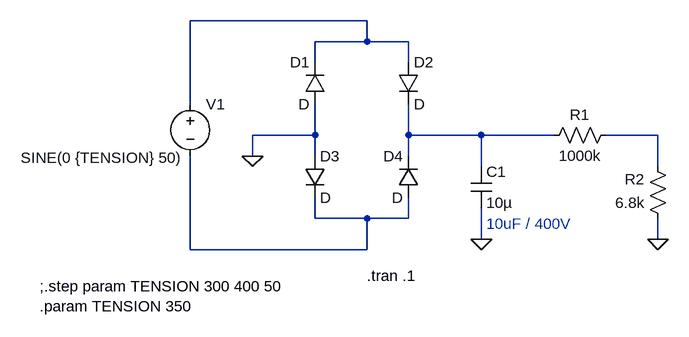
[diagram p0: schematic TensionSensor1.asc]
TensionSensor1.asc, the LTspice schematic file:
Version 4
SHEET 1 880 680
WIRE -272 48 -544 48
WIRE -272 80 -272 48
WIRE -272 80 -352 80
WIRE -208 80 -272 80
WIRE -352 112 -352 80
WIRE -208 112 -208 80
WIRE -544 176 -544 48
WIRE -352 224 -352 176
WIRE -352 224 -448 224
WIRE -208 224 -208 176
WIRE -96 224 -208 224
WIRE 16 224 -96 224
WIRE 176 224 96 224
WIRE -448 256 -448 224
WIRE -352 256 -352 224
WIRE -208 256 -208 224
WIRE -96 272 -96 224
WIRE 176 272 176 224
WIRE -352 352 -352 320
WIRE -272 352 -352 352
WIRE -208 352 -208 320
WIRE -208 352 -272 352
WIRE -96 384 -96 336
WIRE 176 384 176 352
WIRE -544 400 -544 256
WIRE -272 400 -272 352
WIRE -272 400 -544 400
FLAG -96 384 0
FLAG 176 384 0
FLAG -448 256 0
SYMBOL voltage -544 160 R0
WINDOW 3 -261 99 Left 2
WINDOW 123 0 0 Left 0
WINDOW 39 0 0 Left 0
SYMATTR Value SINE(0 {TENSION} 50)
SYMATTR InstName V1
SYMBOL cap -112 272 R0
SYMATTR InstName C1
SYMATTR Value 10µ
SYMBOL res 112 208 R90
WINDOW 0 0 56 VBottom 2
WINDOW 3 32 56 VTop 2
SYMATTR InstName R1
SYMATTR Value 1000k
SYMBOL res 192 368 R180
WINDOW 0 36 76 Left 2
WINDOW 3 36 40 Left 2
SYMATTR InstName R2
SYMATTR Value 6.8k
SYMBOL diode -336 176 R180
WINDOW 0 24 64 Left 2
WINDOW 3 24 0 Left 2
SYMATTR InstName D1
SYMBOL diode -224 112 R0
SYMATTR InstName D2
SYMBOL diode -368 256 R0
SYMATTR InstName D3
SYMBOL diode -192 320 R180
WINDOW 0 24 64 Left 2
WINDOW 3 24 0 Left 2
SYMATTR InstName D4
TEXT -272 440 Left 2 !.tran .1
TEXT -776 456 Left 2 !;.step param TENSION 300 400 50\n.param TENSION 350
TEXT -88 360 Left 2 ;10uF / 400V

The netlist it stands for:
* TensionSensor1.asc
V1 N001 N004 SINE(0 {TENSION} 50)
C1 N002 0 10µ
R1 N003 N002 1000k
R2 0 N003 6.8k
D1 0 N001 D
D2 N001 N002 D
D3 0 N004 D
D4 N004 N002 D
.model D D
.lib standard.dio
.tran .1
;.step param TENSION 300 400 50
.param TENSION 350
* 10uF / 400V
.backanno
.end